# EAGLE design LEA6T-Eval-V1.2 (EAGLE 6.3)

## Sheet 1 of 2
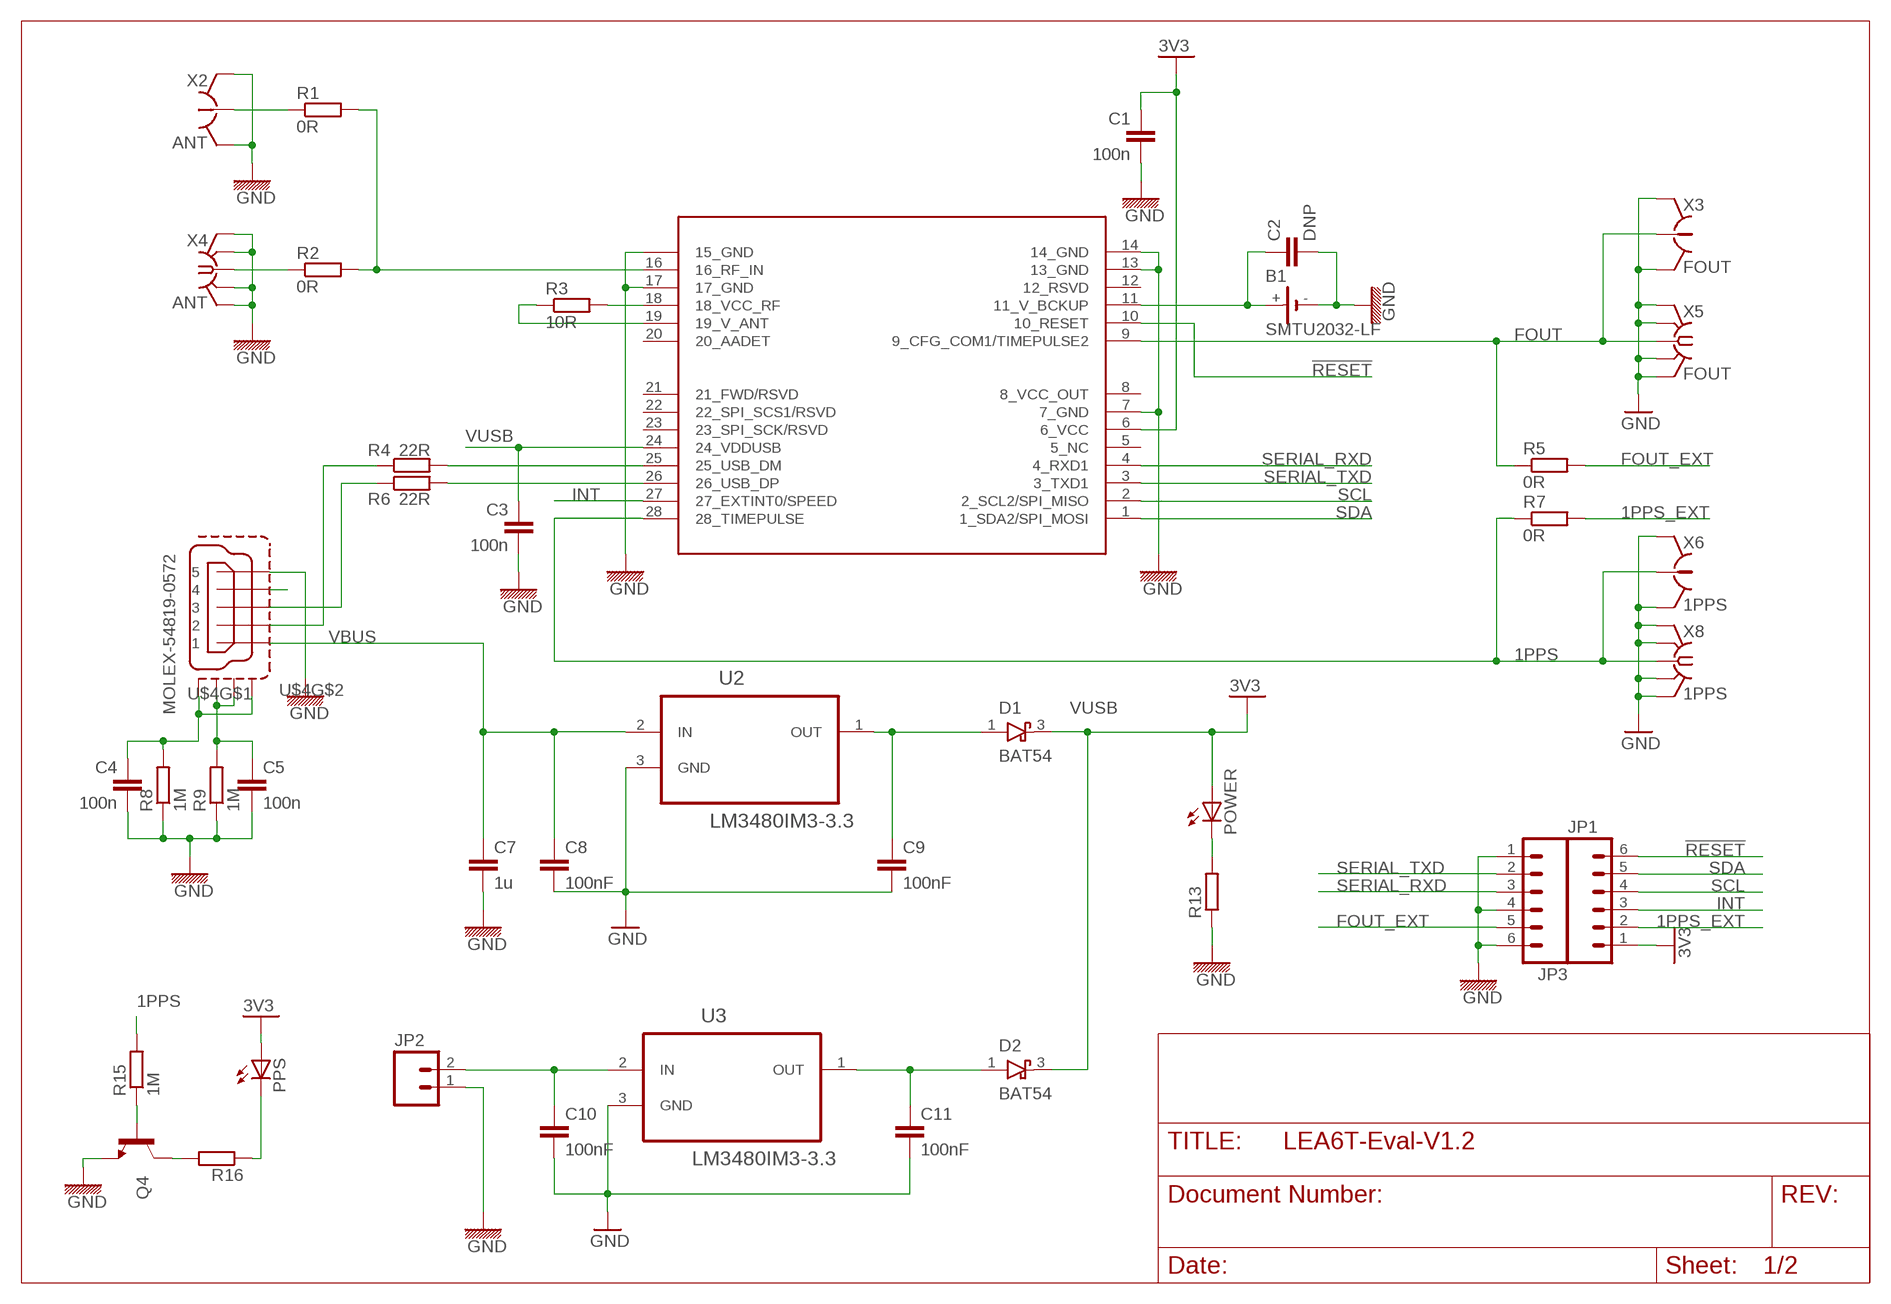
[diagram p0: schematic, sheet 1]

### Parts
B1  SMTU2032-LF  BA2032SMD  [SMTU2032]
C1  100n  C-EU_0603  [0603]
C2  DNP  C-EU_0603  [0603]
C3  100n  C-EU_0603  [0603]
C4  100n  C-EU_0603  [0603]
C5  100n  C-EU_0603  [0603]
C7  1u  C-EU_0603  [0603]
C8  100nF  CAP0603-CAP  [0603-CAP]
C9  100nF  CAP0603-CAP  [0603-CAP]
C10  100nF  CAP0603-CAP  [0603-CAP]
C11  100nF  CAP0603-CAP  [0603-CAP]
D1  BAT54  D_SCHOTTKY_SOT23  [SOT23]
D2  BAT54  D_SCHOTTKY_SOT23  [SOT23]
JP1  M06SIP  [1X06]
JP2  M02PTH  [1X02]
JP3  M06SIP  [1X06]
POWER  LEDSML0603  [SML0603]
PPS  LEDSML0603  [SML0603]
Q4  TRANSISTOR_NPNSOT23  [SOT23]
R1  0R  R-EU_0603  [0603]
R2  0R  R-EU_0603  [0603]
R3  10R  R-EU_0603  [0603]
R4  22R  R-EU_0603  [0603]
R5  0R  R-EU_0603  [0603]
R6  22R  R-EU_0603  [0603]
R7  0R  R-EU_0603  [0603]
R8  1M  R-EU_0603  [0603]
R9  1M  R-EU_0603  [0603]
R13  R-EU_0603  [0603]
R15  1M  R-EU_0603  [0603]
R16  R-EU_0603  [0603]
U1  UBLOX_LEA-6  [UBLOX_LEA-6T]
U2  LM3480IM3-3.3  [SOT95P251X112-3N]
U3  LM3480IM3-3.3  [SOT95P251X112-3N]
U$4  MOLEX-54819-0572  [MOLEX-54819-0572]
X2  ANT  HRS_UFL  [HRS_UFL]
X3  FOUT  HRS_UFL  [HRS_UFL]
X4  ANT  SMA-F-S-EDGE  [SMA-F-S-EDGE]
X5  FOUT  SMA-F-S-EDGE  [SMA-F-S-EDGE]
X6  1PPS  HRS_UFL  [HRS_UFL]
X8  1PPS  SMA-F-S-EDGE  [SMA-F-S-EDGE]

### Nets
1PPS: R7.1 R15.2 U1.28(28_TIMEPULSE) X6.SIG X8.C
1PPS_EXT: JP1.2 R7.2 ; also sheet 2
3V3: C1.1 D1.3(C) D2.3(C) JP1.1 POWER.A PPS.A U1.6(6_VCC) ; also sheet 2
!RESET: JP1.6 U1.10(10_RESET)
FOUT: R5.1 U1.9(9_CFG_COM1/TIMEPULSE2) X3.SIG X5.C
FOUT_EXT: JP3.5 R5.2 ; also sheet 2
GND: B1.- C1.2 C2.2 C3.2 C4.2 C5.2 C7.2 C8.2 C9.2 C10.2 C11.2 JP2.1 JP3.1 JP3.4 JP3.6 Q4.2(E) R8.1 R9.1 R13.1 U1.7(7_GND) U1.13(13_GND) U1.14(14_GND) U1.15(15_GND) U1.17(17_GND) U2.3(GND) U3.3(GND) U$4.5 X2.GND@1(GND) X2.GND@2(GND) X3.GND@1(GND) X3.GND@2(GND) X4.BG1(GND) X4.BG2(GND) X4.TG1(GND) X4.TG2(GND) X5.BG1(GND) X5.BG2(GND) X5.TG1(GND) X5.TG2(GND) X6.GND@1(GND) X6.GND@2(GND) X8.BG1(GND) X8.BG2(GND) X8.TG1(GND) X8.TG2(GND) ; also sheet 2
INT: JP1.3 U1.27(27_EXTINT0/SPEED)
N$1: R2.1 X4.C
N$2: C4.1 R8.2 U$4.M1(S1) U$4.M4(S4)
N$3: R4.2 U1.25(25_USB_DM)
N$4: R6.2 U1.26(26_USB_DP)
N$5: R3.2 U1.18(18_VCC_RF)
N$6: R3.1 U1.19(19_V_ANT)
N$7: C10.1 JP2.2 U3.2(IN)
N$8: C11.1 D2.1(A) U3.1(OUT)
N$12: U$4.4
N$13: R6.1 U$4.3
N$14: R4.1 U$4.2
N$17: B1.+ C2.1 U1.11(11_V_BCKUP)
N$18: R1.1 X2.SIG
N$21: R1.2 R2.2 U1.16(16_RF_IN)
N$22: C5.1 R9.2 U$4.M2(S2) U$4.M3(S3)
N$27: POWER.C R13.2
N$29: Q4.3(C) R16.2
N$30: Q4.1(B) R15.1
N$31: PPS.C R16.1
SCL: JP1.4 U1.2(2_SCL2/SPI_MISO) ; also sheet 2
SDA: JP1.5 U1.1(1_SDA2/SPI_MOSI) ; also sheet 2
SERIAL_RXD: JP3.3 U1.4(4_RXD1) ; also sheet 2
SERIAL_TXD: JP3.2 U1.3(3_TXD1) ; also sheet 2
VBUS: C7.1 C8.1 U2.2(IN) U$4.1
VUSB: C3.1 C9.1 D1.1(A) U1.24(24_VDDUSB) U2.1(OUT)
Unconnected: U1.5(5_NC) U1.8(8_VCC_OUT) U1.12(12_RSVD) U1.20(20_AADET) U1.21(21_FWD/RSVD) U1.22(22_SPI_SCS1/RSVD) U1.23(23_SPI_SCK/RSVD)

## Sheet 2 of 2
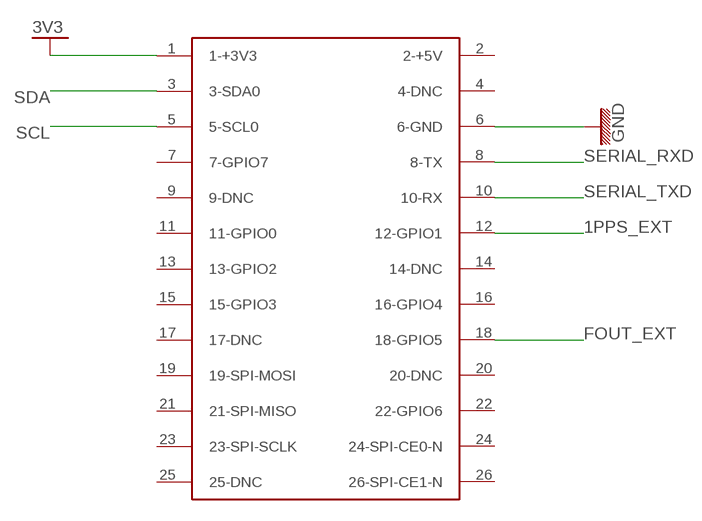
[diagram p1: schematic, sheet 2]

### Parts
U$30  RASPBERRY-PINOCRAP  [RASPBERRY-PI_NOCONNS]

### Nets
1PPS_EXT: U$30.12(12-GPIO1) ; also sheet 1
3V3: U$30.1(1-+3V3) ; also sheet 1
FOUT_EXT: U$30.18(18-GPIO5) ; also sheet 1
GND: U$30.6(6-GND) ; also sheet 1
SCL: U$30.5(5-SCL0) ; also sheet 1
SDA: U$30.3(3-SDA0) ; also sheet 1
SERIAL_RXD: U$30.8(8-TX) ; also sheet 1
SERIAL_TXD: U$30.10(10-RX) ; also sheet 1
Unconnected: U$30.2(2-+5V) U$30.4(4-DNC) U$30.7(7-GPIO7) U$30.9(9-DNC) U$30.11(11-GPIO0) U$30.13(13-GPIO2) U$30.14(14-DNC) U$30.15(15-GPIO3) U$30.16(16-GPIO4) U$30.17(17-DNC) U$30.19(19-SPI-MOSI) U$30.20(20-DNC) U$30.21(21-SPI-MISO) U$30.22(22-GPIO6) U$30.23(23-SPI-SCLK) U$30.24(24-SPI-CE0-N) U$30.25(25-DNC) U$30.26(26-SPI-CE1-N)

## Library data of the parts
B1 = we_misc:BA2032: Generic battery / coin cell
C1-C5 C7 = we_passive:C-EU: Capacitor
C8-C11 = SparkFun:CAP: Capacitor Standard 0603 ceramic capacitor, and 0.1" leaded capacitor.
D1 D2 = we_passive:D_SCHOTTKY: Diode Schottky
JP1 JP3 = SparkFun:M06: Header 6 Standard 6-pin 0.1" header. Use with straight break away headers (SKU : PRT-00116), right angle break away headers (PRT-00553), swiss pins (PRT-00743), machine pins (PRT-00117), and female headers (PRT-00115). Molex polarized connector foot print use with SKU : PRT-08094 with associated crimp pins and housings. NOTES ON THE VARIANTS LOCK and LOCK_LONGPADS... This footprint was designed to help hold the alignment of a through-hole component (i.e. 6-pin header) while soldering it into place. You may notice that each hole has been shifted either up or down by 0.005 of an inch from it's more standard position (which is a perfectly straight line). This slight alteration caused the pins (the squares in the middle) to touch the edges of the holes. Because they are alternating, it causes a "brace" to hold the component in place. 0.005 has proven to be the perfect amount of "off-center" position when using our standard breakaway headers. Although looks a little odd when you look at the bare footprint, once you have a header in there, the alteration is very hard to notice. Also, if you push a header all the way into place, it is covered up entirely on the bottom side. This idea of altering the position of holes to aid alignment will be further integrated into the Sparkfun Library for other footprints. It can help hold any component with 3 or more connection pins.
JP2 = SparkFun:M02: Header 2 Standard 2-pin 0.1" header. Use with straight break away headers (SKU : PRT-00116), right angle break away headers (PRT-00553), swiss pins (PRT-00743), machine pins (PRT-00117), and female headers (PRT-00115). Molex polarized connector foot print use with SKU : PRT-08233 with associated crimp pins and housings.
POWER PPS = led:LED: LED OSRAM: - CHIPLED LG R971, LG N971, LY N971, LG Q971, LY Q971, LO R971, LY R971 LH N974, LH R974 LS Q976, LO Q976, LY Q976 LO Q996 - Hyper CHIPLED LW Q18S LB Q993, LB Q99A, LB R99A - SideLED LS A670, LO A670, LY A670, LG A670, LP A670 LB A673, LV A673, LT A673, LW A673 LH A674 LY A675 LS A676, LA A676, LO A676, LY A676, LW A676 LS A679, LY A679, LG A679 - Hyper Micro SIDELED® LS Y876, LA Y876, LO Y876, LY Y876 LT Y87S - SmartLED LW L88C, LW L88S LB L89C, LB L89S, LG L890 LS L89K, LO L89K, LY L89K LS L896, LA L896, LO L896, LY L896 - TOPLED LS T670, LO T670, LY T670, LG T670, LP T670 LSG T670, LSP T670, LSY T670, LOP T670, LYG T670 LG T671, LOG T671, LSG T671 LB T673, LV T673, LT T673, LW T673 LH T674 LS T676, LA T676, LO T676, LY T676, LB T676, LH T676, LSB T676, LW T676 LB T67C, LV T67C, LT T67C, LS T67K, LO T67K, LY T67K, LW E67C LS E67B, LA E67B, LO E67B, LY E67B, LB E67C, LV E67C, LT E67C LW T67C LS T679, LY T679, LG T679 LS T770, LO T770, LY T770, LG T770, LP T770 LB T773, LV T773, LT T773, LW T773 LH T774 LS E675, LA E675, LY E675, LS T675 LS T776, LA T776, LO T776, LY T776, LB T776 LHGB T686 LT T68C, LB T68C - Hyper Mini TOPLED® LB M676 - Mini TOPLED Santana® LG M470 LS M47K, LO M47K, LY M47K Source: http://www.osram.convergy.de LUXEON: - LUMILED® LXK2-PW12-R00, LXK2-PW12-S00, LXK2-PW14-U00, LXK2-PW14-V00 LXK2-PM12-R00, LXK2-PM12-S00, LXK2-PM14-U00 LXK2-PE12-Q00, LXK2-PE12-R00, LXK2-PE12-S00, LXK2-PE14-T00, LXK2-PE14-U00 LXK2-PB12-K00, LXK2-PB12-L00, LXK2-PB12-M00, LXK2-PB14-N00, LXK2-PB14-P00, LXK2-PB14-Q00 LXK2-PR12-L00, LXK2-PR12-M00, LXK2-PR14-Q00, LXK2-PR14-R00 LXK2-PD12-Q00, LXK2-PD12-R00, LXK2-PD12-S00 LXK2-PH12-R00, LXK2-PH12-S00 LXK2-PL12-P00, LXK2-PL12-Q00, LXK2-PL12-R00 Source: www.luxeon.com KINGBRIGHT: KA-3528ASYC Source: www.kingbright.com
Q4 = SparkFun:TRANSISTOR_NPN: Transistor NPN BJT configuration in SOT23 package. MMBT2222 is the common NPN we use. Double check BCE configuration again layout.
R1-R9 R13 R15 R16 = we_passive:R-EU: Resistor
U1 = Ava:UBLOX_LEA-6
U2 U3 = Ava:LM3480IM3-3.3: Low-Dropout Linear Voltage; MPN: LM3480IM3-3.3; OC_FARNELL: 1469102; OC_NEWARK: 41K4825; PACKAGE: SOT-3; SUPPLIER: National Semiconductor
U$4 = Ava:MOLEX-54819-0572
U$30 = RaspberryPi:RASPBERRY-PI: Raspberry Pi Board <http://www.raspberrypi.org/> Jacques Lagnel V1.0 (beta) 2012 Board dimension: Forum 3D model <http://www.raspberrypi.org/forum/general-discussion/mechanical-profile-3d-models?value=3d%20model&type=1&include=1&search=1&ret=all> The GPIO Connector (P1): http://elinux.org/RPi_Low-level_peripherals
X2 X3 X6 = we_conn:HRS_UFL: Hirose U.FL SMT
X4 X5 X8 = we_conn:SMA-F

## Net classes
0 default: width 0.203 mm

## Board
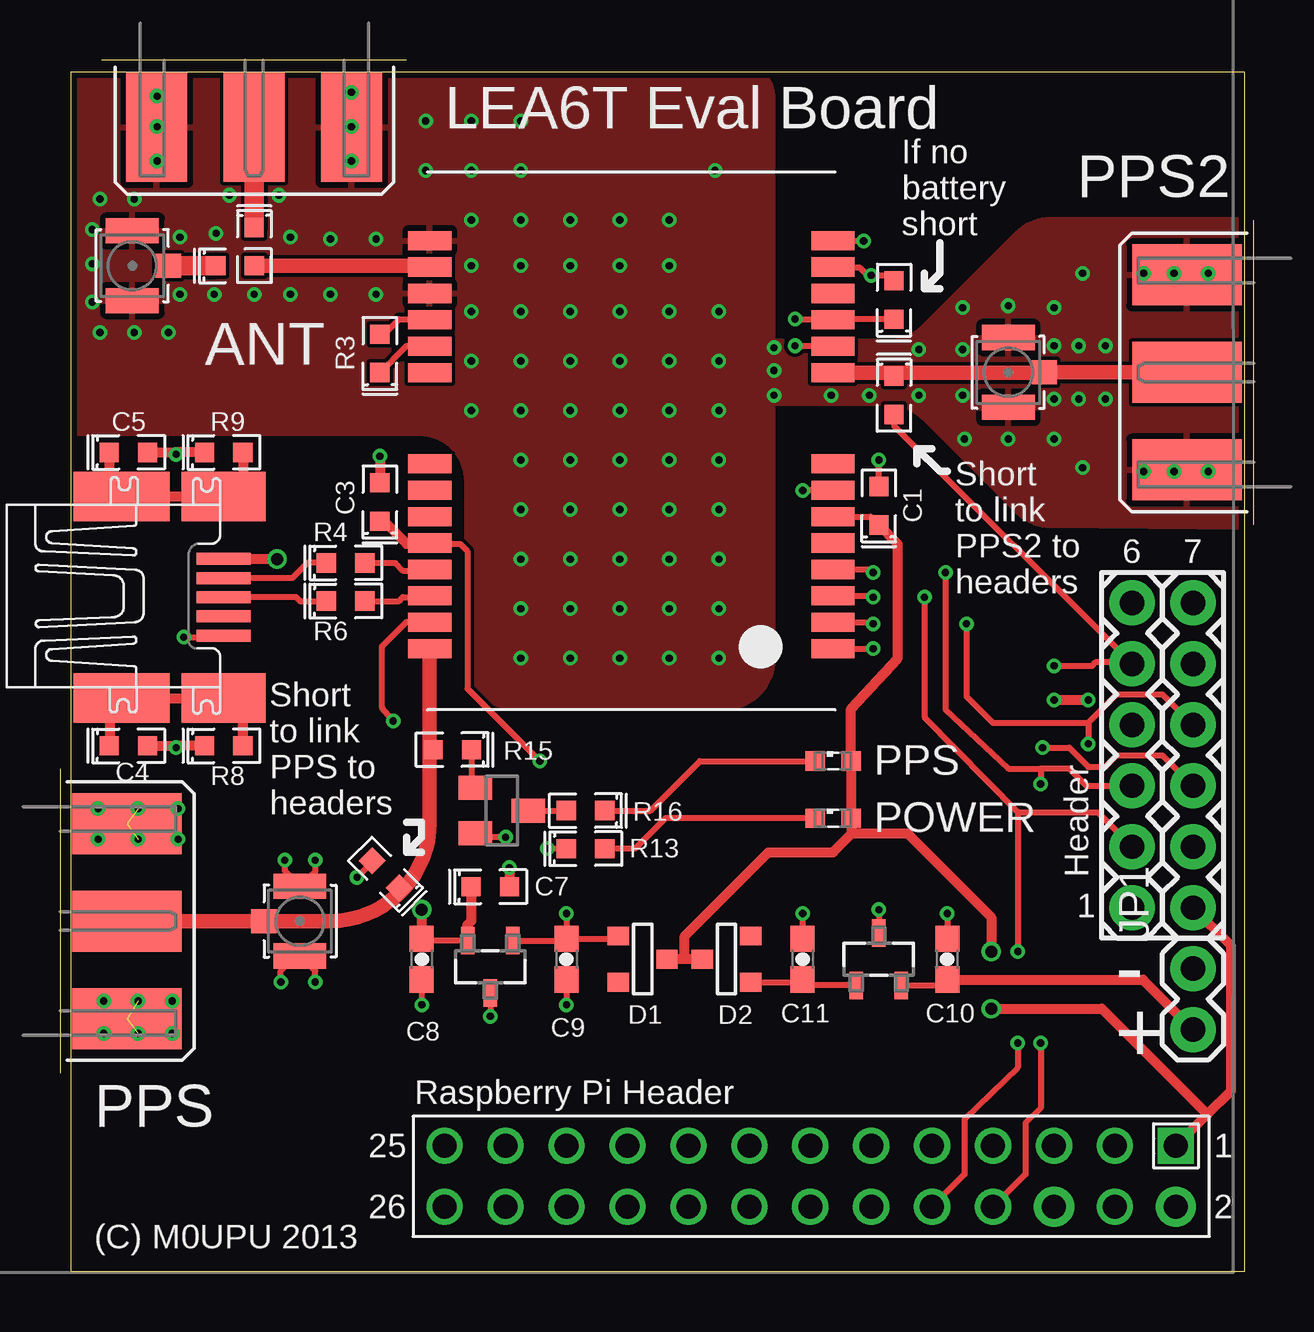
[diagram p2: board, top side]
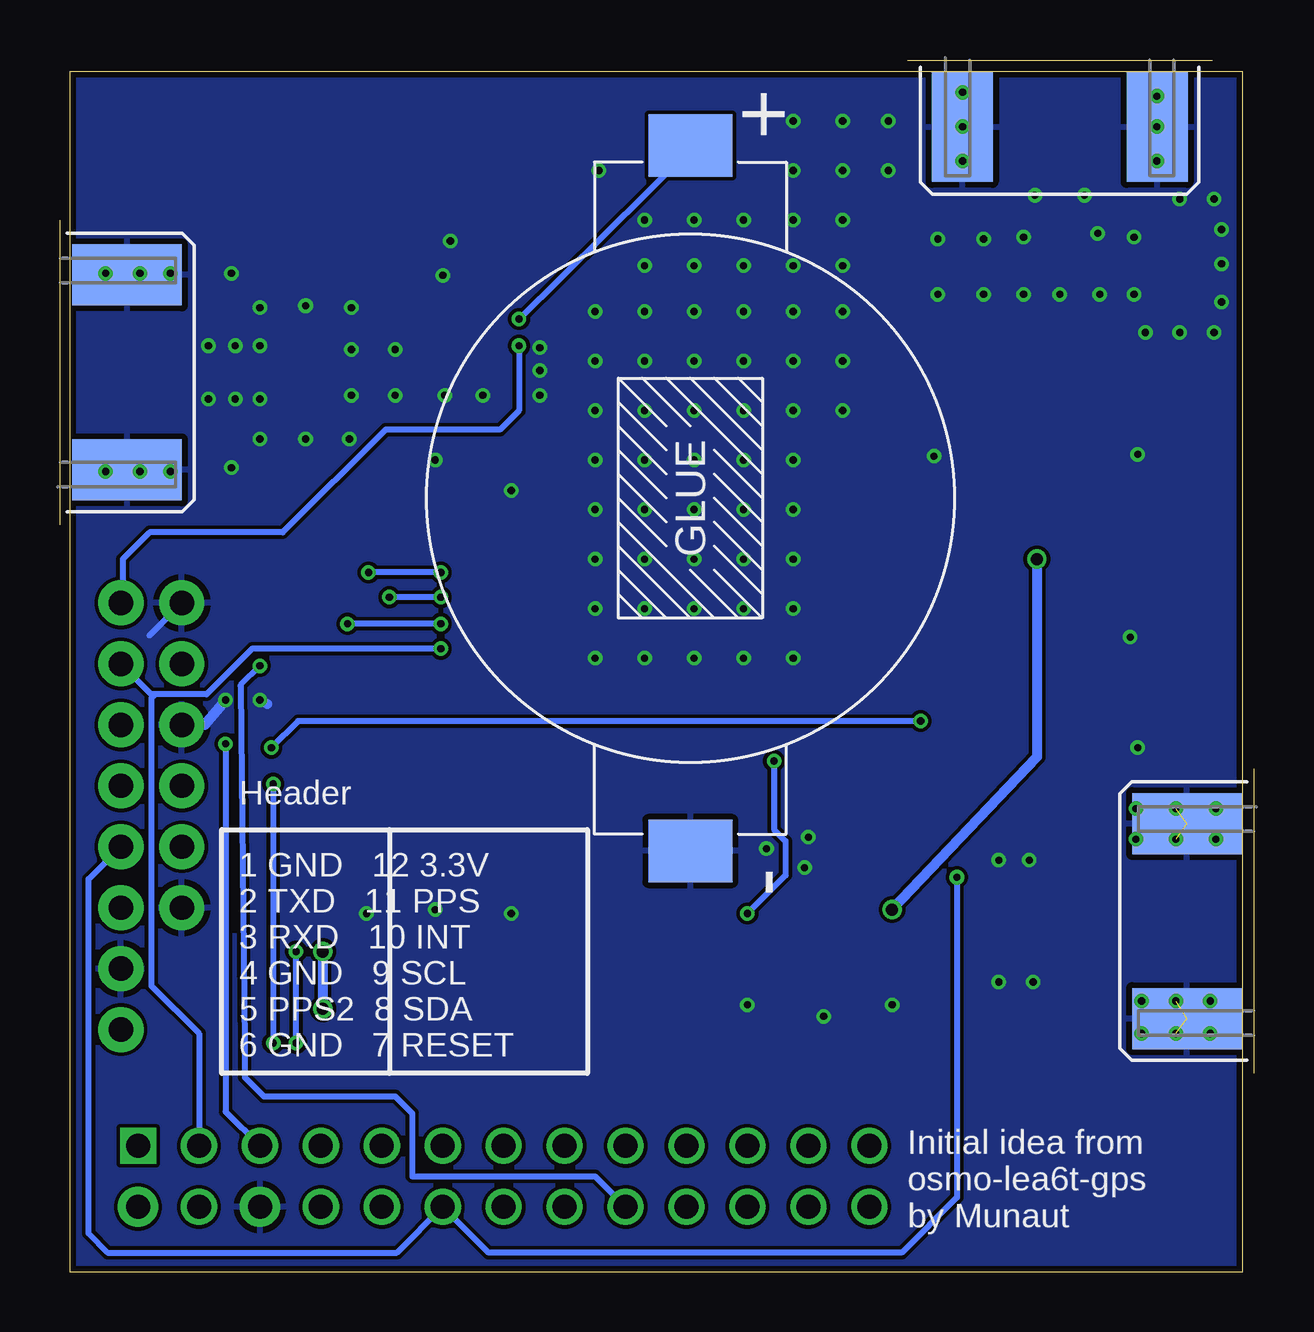
[diagram p3: board, bottom side, seen from below]

Size 48.9 x 50 mm. Coordinates in mm from the lower left corner, seen from the top.
Outline: 0,50 48.9,50 48.9,0 0,0 0,50
Copper layers (1*16): Top 0.035mm / dielectric 1.5mm / Bottom 0.035mm
Design rules "Hackvana": minimum track width 6mil, minimum drill 0.29mm, track to track 6mil, track to pad 6mil, pad to pad 6mil, via to via 6mil, smd to smd 0mil, copper to edge 10mil, drill to drill 10mil, minimum pad ring 10mil, minimum via ring 6mil, stop-mask expansion 2mil, vias tented up to drill 100mil, thermal gap 10mil

### Footprints (pad centres in the part's own frame; a part is rotated, then mirrored left to right if it is on the bottom)
SMTU2032 = smd 2.6 x 3.5: + -14.7,0; - 14.7,0
0603 = smd 0.8 x 0.8: 1 -0.8,0; 2 0.8,0
0603-CAP = smd 1.1 x 1: 1 -0.85,0; 2 0.85,0
SOT23 = smd 0.787 x 0.889: 1 0.965,1.016; 2 -0.965,1.016; 3 0,-1.016
1X06 = drill 1.016 pad 1.88: 1 0,0; 2 2.54,0; 3 5.08,0; 4 7.62,0; 5 10.16,0; 6 12.7,0
1X02 = drill 1.016 pad 1.88: 1 0,0; 2 2.54,0
SML0603 = smd 0.8 x 0.8: A 0.75,0; C -0.75,0
SOT23' = smd 1 x 1.4: 1 -0.95,-1.1; 2 0.95,-1.1; 3 0,1.1
UBLOX_LEA-6T = smd 1.8 x 0.8: 1 8.4,-8.65; 2 8.4,-7.55; 3 8.4,-6.45; 4 8.4,-5.35; 5 8.4,-4.25; 6 8.4,-3.15; 7 8.4,-2.05; 8 8.4,-0.95; 9 8.4,2.85; 10 8.4,3.95; 11 8.4,5.05; 12 8.4,6.15; 13 8.4,7.25; 14 8.4,8.35; 15 -8.4,8.35; 16 -8.4,7.25; 17 -8.4,6.15; 18 -8.4,5.05; 19 -8.4,3.95; 20 -8.4,2.85; 21 -8.4,-0.95; 22 -8.4,-2.05; 23 -8.4,-3.15; 24 -8.4,-4.25; 25 -8.4,-5.35; 26 -8.4,-6.45; 27 -8.4,-7.55; 28 -8.4,-8.65
SOT95P251X112-3N = smd 0.559 x 1.143: 1 -0.94,-1.092; 2 0.94,-1.092; 3 0,1.092
MOLEX-54819-0572 = smd 2.25 x 0.5: 1 0,1.6; 2 0,0.8; 3 0,0; 4 0,-0.8; 5 0,-1.6 | smd 4 x 2.05: M1 -4.25,-4.2; M2 -4.25,4.2 | smd 3.5 x 2.05: M3 0,4.2; M4 0,-4.2
RASPBERRY-PI_NOCONNS = drill 1 square: 1 -34.29,22.86 | drill 1 pad 1.676: 2 -34.29,25.4; 6 -29.21,25.4 | drill 1: 3 -31.75,22.86; 4 -31.75,25.4; 5 -29.21,22.86; 7 -26.67,22.86; 8 -26.67,25.4; 9 -24.13,22.86; 10 -24.13,25.4; 11 -21.59,22.86; 12 -21.59,25.4; 13 -19.05,22.86; 14 -19.05,25.4; 15 -16.51,22.86; 16 -16.51,25.4; 17 -13.97,22.86; 18 -13.97,25.4; 19 -11.43,22.86; 20 -11.43,25.4; 21 -8.89,22.86; 22 -8.89,25.4; 23 -6.35,22.86; 24 -6.35,25.4; 25 -3.81,22.86; 26 -3.81,25.4
HRS_UFL = smd 1.05 x 2.2: GND@1 -1.452,0; GND@2 1.452,0 | smd 1 x 1.05: SIG 0,-1.502
SMA-F-S-EDGE = smd 4.572 x 2.54 bottom: BG1 2.794,-4.064; BG2 2.794,4.064 | smd 4.572 x 2.54: C 2.794,0; TG1 2.794,-4.064; TG2 2.794,4.064

### Placement (x,y rotation side)
B1  23.02,32.23 270 bottom
C1  33.66,31.91 90 top
C2  34.29,40.48 90 top
C3  12.86,32.07 90 top
C4  2.38,21.91 0 top
C5  2.38,34.13 0 top
C7  17.46,16.03 0 top
C8  14.61,13.02 270 top
C9  20.64,13.02 270 top
C10  36.51,13.02 90 top
C11  30.48,13.02 90 top
D1  23.81,13.02 90 top
D2  27.3,13.02 270 top
JP1  46.75,15.16 90 top
JP2  46.75,12.62 270 top
JP3  44.21,15.16 90 top
POWER  31.75,18.89 0 top
PPS  31.75,21.27 0 top
Q4  [SOT23']  17.94,19.21 270 top
R1  6.83,41.91 0 top
R2  7.62,42.7 270 top
R3  12.86,38.26 90 top
R4  11.43,29.53 0 top
R5  34.29,36.51 270 top
R6  11.43,27.94 0 top
R7  13.1,16.55 135 top
R8  6.35,21.91 0 top
R9  6.35,34.13 0 top
R13  21.43,17.62 0 top
R15  15.88,21.75 180 top
R16  21.43,19.21 180 top
U1  23.34,34.61 0 top
U2  17.46,12.7 180 top
U3  33.66,13.02 0 top
U$4  6.35,28.1 0 top
U$30  11.75,28.1 180 top
X2  2.54,41.91 90 top
X3  39.05,37.47 90 top
X4  7.62,50.48 270 top
X5  49.29,37.47 180 top
X6  9.53,14.61 270 top
X8  -0.48,14.61 0 top

### Tracks (layer width: path | path; a pad name or v marks a point on that pad's centre or on a via)
1PPS
  Top 0.254: R15.2 15.07,21.57 arc-90 14.94,21.43 | 14.94,18.75 14.94,17.64 14.76,17.46 14.76,17.14 14.45,16.83 14.45,16.77 R7.1
  Top 0.61: U1.28 14.94,21.43 14.94,18.75 arc-90 10.79,14.61 X6.SIG X8.C
1PPS_EXT  (via drill 0.3)
  Top 0.254: R7.2 12.53,17.06 v11.91,16.43
  Bottom 0.254: v11.91,16.43 11.91,3.1 14.21,0.79 31.43,0.79 U$30.12 35.24,0.79 47.31,0.79 48.1,1.59 48.1,16.35 JP1.2
3V3  (via drill 0.5)
  Top 0.254: U1.6 33.31,31.46 C1.1
  Top 0.406: 25.56,13.02 D1.3 | D2.3 25.56,13.02 | 25.56,13.02 25.56,13.97 29.05,17.46 31.75,17.46 32.54,18.26 | 32.54,18.26 32.54,18.85 POWER.A PPS.A 32.5,23.45 34.45,25.56 34.45,30.32 C1.1 | U$30.1 47.35,6.55 | 47.35,6.55 48.34,7.54 48.34,13.57 JP1.1 | 32.54,18.26 34.85,18.26 38.34,14.76 v38.34,13.34 | v38.34,10.95 42.94,10.95 47.35,6.55
  Bottom 0.406: v38.34,13.34 v38.34,10.95
!RESET  (via drill 0.3)
  Top 0.254: U1.10 30.18,38.56 v30.16,38.58
  Bottom 0.254: v30.16,38.58 30.16,35.88 30.96,35.08 35.72,35.08 40.01,30.8 45.56,30.8 46.67,29.69 46.67,27.94 JP1.6
FOUT
  Top 0.406: U1.9 34.15,37.46 R5.1
  Top 0.61: U1.9 40.55,37.46 X3.SIG X5.C
FOUT_EXT  (via drill 0.3)
  Top 0.254: R5.2 34.29,35.24 JP3.5 44.13,25.4 42.7,25.4 42.55,25.24 v40.96,25.24
  Bottom 0.254: U$30.18 26.99,3.97 34.61,3.97 34.61,6.59 35.32,7.3 40.8,7.3 41.59,8.1 41.59,9.45 41.75,24.37 41.75,24.45 v40.96,25.24
GND  (via drill 0.3)  (6 unrouted)
  Top 0.254: v18.1,18.1 17,18.1 Q4.2 | R13.1 v19.84,17.62 | U2.3 v17.46,10.64 | C9.2 v20.64,11.11 | C8.2 v14.61,11.11 | v33.66,15.08 U3.3 | v36.51,14.92 C10.2 | v30.48,14.92 C11.2 | C2.2 34.06,41.51 v33.34,41.51 33.18,41.51 32.86,41.83 31.76,41.83 U1.13 | U1.14 33,42.96 v33.02,42.94 | C1.2 v33.66,33.81 | U1.7 30.49,32.56 v30.48,32.54 | v8.73,12.06 8.73,12.54 9.05,12.86 | v10.16,17.14 10.16,16.67 9.84,16.35 | v8.89,17.14 8.89,16.69 X6.GND@1 | v10.16,12.06 10.16,12.52 X6.GND@2 | v4.68,26.43 6.35,26.43 U$4.5 | v4.21,9.92 v4.21,11.27 v2.78,11.27 | 1.59,10.48 1.59,10.16 v1.35,9.92 | 1.75,10.64 1.75,10.87 v1.35,11.27 | v1.11,18.02 v1.11,19.29 v2.78,19.29 v4.45,19.29 v4.45,18.02
  Top 0.406: v12.86,33.97 C3.2 | v18.26,16.83 C7.2 | R8.1 4.37,21.91 | C4.2 4.37,21.91 | 4.37,21.91 v4.37,21.83 | C5.2 4.29,34.13 v4.37,34.05 4.45,34.13 R9.1 | X8.TG1 2.16,10.54 2.06,10.64 1.75,10.64 1.59,10.48 | v42.39,23.81 v40.96,23.81
  Bottom 0.254: JP3.6 45.56,26.51
  Bottom 0.406: JP3.4 43.26,22.78 v42.39,23.81 | v40.96,23.81 40.64,23.65
  other vias: 31.67,36.51 35.32,38.42 35.32,36.51 37.15,36.51 37.15,38.42 40.96,36.35 40.96,38.58 41.99,38.58 41.99,36.35 29.29,36.51 29.29,38.5 29.29,37.54 39.05,40.24 40.96,40.16 37.15,40.16 39.05,34.69 40.96,34.69 37.23,34.69 43.1,38.58 43.1,36.35 45.96,33.34 44.69,33.34 47.39,33.34 45.96,41.59 44.69,41.59 47.39,41.59 42.15,41.59 42.15,33.5 9.13,40.72 12.7,40.72 5.95,40.72 10.79,40.72 7.62,40.72 12.7,43.02 10.79,43.02 6.03,43.26 3.57,47.7 16.67,41.91 16.67,43.81 16.67,45.88 16.67,40.01 16.67,37.94 16.67,35.88 20.8,41.91 20.8,43.81 20.8,40.01 20.8,37.94 20.8,35.88 18.73,41.91 18.73,43.81 18.73,45.88 18.73,40.01 18.73,37.94 18.73,35.88 22.86,41.91 22.86,43.81 22.86,40.01 22.86,37.94 22.86,35.88 24.92,41.91 24.92,43.81 24.92,40.01 24.92,37.94 24.92,35.88 26.83,45.88 26.99,40.01 26.99,37.94 26.99,35.88 18.73,33.81 18.73,31.75 18.73,29.69 22.86,33.81 22.86,31.75 22.86,29.69 20.8,33.81 20.8,31.75 20.8,29.69 24.92,33.81 24.92,31.75 24.92,29.69 26.99,33.81 26.99,31.75 26.99,29.69 18.73,27.62 18.73,25.56 22.86,27.62 22.86,25.56 20.8,27.62 20.8,25.56 24.92,27.62 24.92,25.56 26.99,27.62 26.99,25.56 0.87,40.4 9.13,43.1 0.87,41.99 6.59,44.85 0.87,43.42 2.62,44.69 33.26,36.51 2.78,18.02 2.78,9.92 2.62,39.13 1.19,39.13 3.57,48.97 3.57,46.28 11.67,47.7 11.67,49.13 11.67,46.28 16.67,47.94 18.73,47.94 1.19,44.69 4.05,39.13 4.52,40.72 4.52,43.1 8.65,44.85 14.76,47.94 14.76,45.88
  pour Bottom: 0,50.8 48.9,50.24 48.9,0.08 0,0
  pour Top: 48.9,43.81 40.83,43.81 arc45 39.42,43.23 35.51,39.32 arc-45 34.1,38.73 29.21,38.73 29.21,36.2 34.1,36.2 arc-45 35.51,35.61 39.43,31.69 arc45 40.82,31.11 48.97,31.04
  pour Top: 0,50.8 27.21,50.8 arc-90 29.21,48.8 29.21,25.5 arc-90 27.21,23.5 18.51,23.5 arc-90 16.51,25.5 16.51,32.92 arc90 14.51,34.92 0.32,34.92
INT  (via drill 0.3)
  Top 0.254: U1.27 13.96,27.06 12.94,26.04 12.94,23.5 v13.41,22.94 | v40.48,21.83 41.59,21.83 42.39,21.03 43.1,21.03 43.58,21.51 45.48,21.51 JP1.3
  Bottom 0.254: v13.41,22.94 39.37,22.94 v40.48,21.83
N$1
  Top 0.813: X4.C R2.1
N$2
  Top 0.406: R8.2 7.15,23.1 6.79,23.46 | 6.79,23.46 U$4.M4 | 1.59,23.5 1.7,23.5 U$4.M1 6.75,23.9 6.83,23.97 6.83,23.5 6.79,23.46 | 1.59,23.5 C4.1
  Top 0.813: 1.59,23.5 1.55,23.5
N$3
  Top 0.254: R4.2 13.49,29.53 13.81,29.21 14.89,29.21
  Top 0.406: 14.89,29.21 U1.25
N$4
  Top 0.254: R6.2 13.65,27.94 13.81,28.1 14.88,28.1
  Top 0.406: 14.88,28.1 U1.26
N$5
  Top 0.254: R3.2 13.02,39.06 13.65,39.69 14.91,39.69 U1.18
N$6
  Top 0.254: U1.19 13.96,38.56 R3.1
N$7
  Top 0.254: U3.2 36.27,11.93 C10.1
  Top 0.406: C10.1 44.66,12.17 JP2.2
N$8
  Top 0.254: U3.1 30.72,11.93 C11.1 30.36,12.05 D2.1
N$13
  Top 0.254: R6.1 9.53,27.94 9.37,28.1 U$4.3
N$14
  Top 0.254: R4.1 9.84,29.53 9.21,28.89 6.7,28.89
  Top 0.406: U$4.2 6.7,28.9 6.7,28.89
N$17  (via drill 0.3)
  Top 0.254: C2.1 31.76,39.68 U1.11 31.71,39.69 v30.16,39.69
  Bottom 0.254: B1.+ 23.02,46.75 v30.16,39.69
N$18
  Top 0.813: X2.SIG R1.1
N$21
  Top 0.406: R2.2 R1.2
  Top 0.61: R2.2 14.94,41.91 U1.16
N$22
  Top 0.406: R9.2 7.15,33.1 U$4.M3 U$4.M2 1.58,32.82 C5.1
N$27
  Top 0.254: POWER.C 24.77,18.89 23.5,17.62 R13.2
N$29
  Top 0.254: Q4.3 R16.2
N$30
  Top 0.254: R15.1 16.68,20.32 arc90 Q4.1
N$31
  Top 0.254: R16.1 24.13,19.21 26.19,21.27 PPS.C
SCL  (via drill 0.3)
  Top 0.254: U1.2 33.35,27.06 v33.42,26.99 | 42.39,22.86 43.58,24.05 45.48,24.05 JP1.4 | 42.39,22.86 v42.39,21.99 | v37.31,26.99 37.31,23.97 38.42,22.86 42.39,22.86
  Bottom 0.254: v33.42,26.99 v37.31,26.99 | v42.39,21.99 42.39,6.67 U$30.5
SDA  (via drill 0.3)
  Top 0.254: U1.1 v33.41,25.96 v33.42,25.96
  Bottom 0.254: v33.42,25.96 41.27,25.96 43.18,24.05 45.32,24.05 | 45.32,24.05 45.48,24.05 JP1.5 | 45.32,24.05 45.48,23.89 45.48,11.91 43.5,9.92 U$30.3
SERIAL_RXD  (via drill 0.3)
  Top 0.254: U1.4 33.29,29.26 v33.42,29.13 | 44.13,20.16 JP3.3 42.31,20.24 41.59,20.95 40.4,20.95 | v36.43,29.13 36.43,23.42 39.05,20.95 40.4,20.95 | 40.4,20.95 v40.4,20.32 | v40.4,9.53 40.4,6.83 39.77,6.19 39.77,4.05 U$30.8
  Bottom 0.254: v33.42,29.13 v36.43,29.13 | v40.4,20.32 v40.4,9.53
SERIAL_TXD  (via drill 0.3)
  Top 0.254: U1.3 33.36,28.16 v33.42,28.1 | JP3.2 42.78,19.13 39.45,19.13 | v35.56,28.1 35.56,23.1 39.45,19.13 | 39.45,19.13 v39.45,13.34 | v39.45,9.53 39.45,8.49 37.23,6.35 37.23,4.05 U$30.10
  Bottom 0.254: v33.42,28.1 v35.56,28.1 | v39.45,9.53 v39.45,13.34
VBUS  (via drill 0.5)
  Top 0.254: U2.2 14.68,13.79 C8.1
  Top 0.406: v8.56,29.7 v8.57,29.69 v8.57,29.7 U$4.1 | v14.61,15.08 C8.1 | C7.1 16.66,14.6 16.51,14.45 16.51,13.8 U2.2
  Bottom 0.406: v8.57,29.69 8.57,21.43 v14.61,15.08
VUSB  (via drill 0.3)
  Top 0.254: U2.1 20.56,13.79 C9.1 | C9.1 22.68,13.87 D1.1 | 14.9,30.32 16.19,30.32 16.51,30 16.51,24.29 v19.53,21.27 | v20.64,14.92 C9.1
  Top 0.406: C3.1 13.02,31.27 13.97,30.32 14.9,30.32 U1.24
  Bottom 0.254: v19.53,21.27 19.53,18.41 19.05,17.94 19.05,16.51 v20.64,14.92

### Text on the board
tPlace: LEA6T Eval Board | PPS2 | If no / battery / short | ANT | 6 | 7 | Short / to link / PPS2 to / headers | Short / to link / PPS to / headers | Header | 1 | - | + | Raspberry Pi Header | PPS | 25 | 1 | 26 | 2 | (C) M0UPU 2013
bPlace: Header / / 1 GND 12 3.3V / 2 TXD 11 PPS / 3 RXD 10 INT / 4 GND 9 SCL / 5 PPS2 8 SDA / 6 GND 7 RESET | Initial idea from / osmo-lea6t-gps / by Munaut